# EAGLE design dlp.vco.v1.1.3.main (EAGLE 7.2.0)
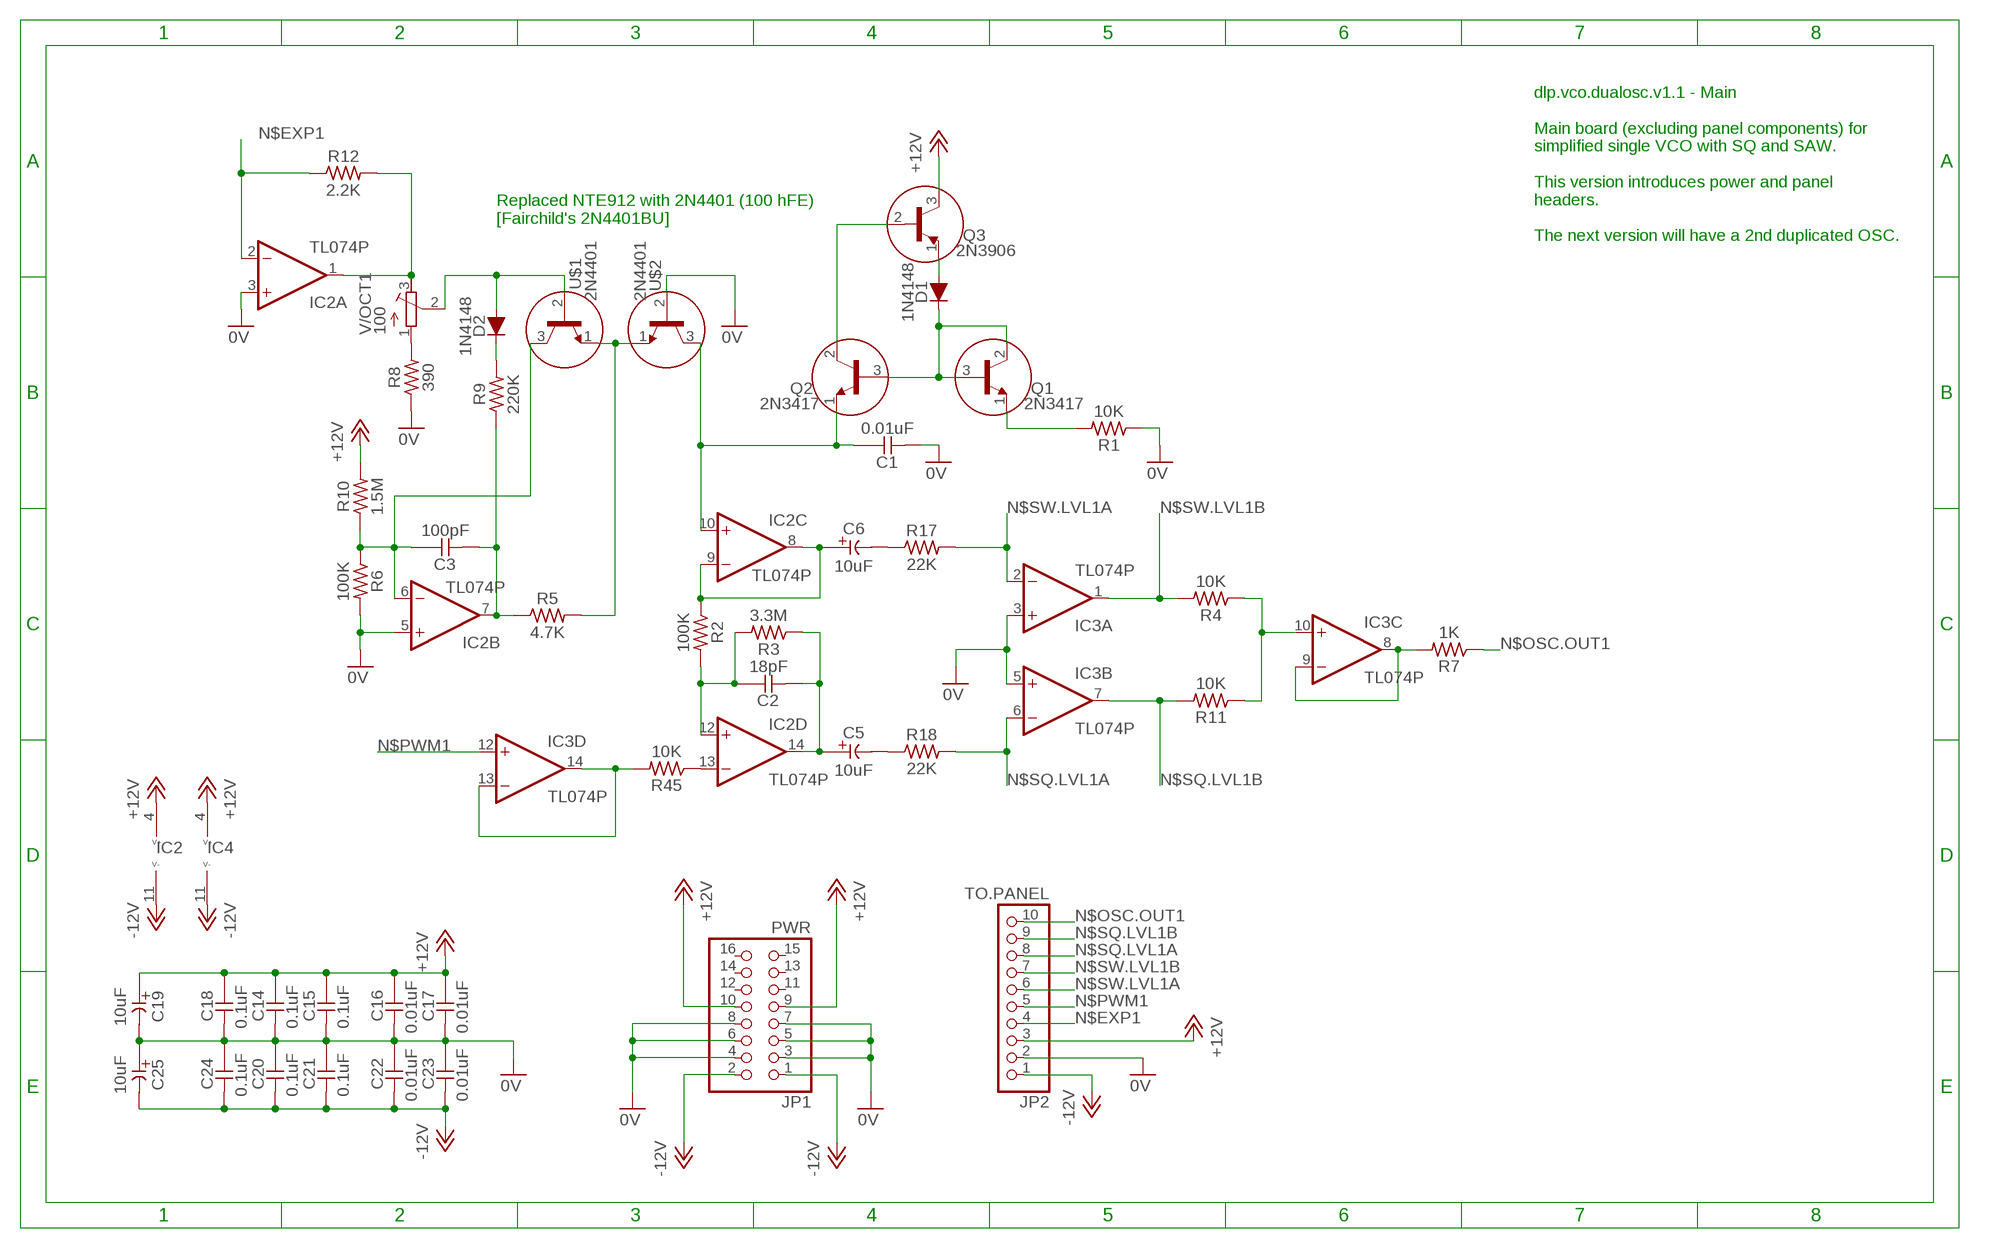
[diagram p0: schematic, sheet 1]

## Parts
C1  0.01uF  CC-US025-024X044  [C025-024X044]
C2  18pF  CC-US025-024X044  [C025-024X044]
C3  100pF  CC-US025-024X044  [C025-024X044]
C5  10uF  CE-USE2-5  [E2-5]
C6  10uF  CE-USE2-5  [E2-5]
C14  0.1uF  CC-US025-024X044  [C025-024X044]
C15  0.1uF  CC-US025-024X044  [C025-024X044]
C16  0.01uF  CC-US025-024X044  [C025-024X044]
C17  0.01uF  CC-US025-024X044  [C025-024X044]
C18  0.1uF  CC-US025-024X044  [C025-024X044]
C19  10uF  CE-USE2-5  [E2-5]
C20  0.1uF  CC-US025-024X044  [C025-024X044]
C21  0.1uF  CC-US025-024X044  [C025-024X044]
C22  0.01uF  CC-US025-024X044  [C025-024X044]
C23  0.01uF  CC-US025-024X044  [C025-024X044]
C24  0.1uF  CC-US025-024X044  [C025-024X044]
C25  10uF  CE-USE2-5  [E2-5]
D1  1N4148  [DO35-7]
D2  1N4148  [DO35-7]
IC2  TL074P  [DIL14]
IC3  TL074P  [DIL14]
JP1  PWR  PINHD-2X8  [2X08]
JP2  TO.PANEL  PINHD-1X10  [1X10]
Q1  2N3417  [TO92]
Q2  2N3417  [TO92]
Q3  2N3906  [TO92]
R1  10K  R0309/10  [0309/10]
R2  100K  R0309/10  [0309/10]
R3  3.3M  R0309/10  [0309/10]
R4  10K  R0309/10  [0309/10]
R5  4.7K  R0309/10  [0309/10]
R6  100K  R0309/10  [0309/10]
R7  1K  R0309/10  [0309/10]
R8  390  R0309/10  [0309/10]
R9  220K  R0309/10  [0309/10]
R10  1.5M  R0309/10  [0309/10]
R11  10K  R0309/10  [0309/10]
R12  2.2K  R0309/10  [0309/10]
R17  22K  R0309/10  [0309/10]
R18  22K  R0309/10  [0309/10]
R45  10K  R0309/10  [0309/10]
U$1  2N4401  [TO92]
U$2  2N4401  [TO92]
V/OCT1  100  R-TRIMM3296Y  [RTRIM3296Y]

## Nets
0V: C1.2 C14.2 C15.2 C16.2 C17.2 C18.2 C19.- C20.1 C21.1 C22.1 C23.1 C24.1 C25.+ IC2.3(A:+IN) IC2.5(B:+IN) IC3.3(A:+IN) IC3.5(B:+IN) JP1.3 JP1.4 JP1.5 JP1.6 JP1.7 JP1.8 JP2.2 R1.1 R6.2 R8.1 U$2.2(B)
+12V: C14.1 C15.1 C16.1 C17.1 C18.1 C19.+ IC2.4(P:V+) IC3.4(P:V+) JP1.9 JP1.10 JP2.3 Q3.3(C) R10.2
-12V: C20.2 C21.2 C22.2 C23.2 C24.2 C25.- IC2.11(P:V-) IC3.11(P:V-) JP1.1 JP1.2 JP2.1
N$1: C1.1 IC2.10(C:+IN) Q2.1(E) U$2.3(C)
N$2: Q2.2(C) Q3.2(B)
N$3: D1.A Q3.1(E)
N$4: C6.+ IC2.8(C:OUT) IC2.9(C:-IN) R2.1
N$5: D1.C Q1.2(C) Q1.3(B) Q2.3(B)
N$6: Q1.1(E) R1.2
N$7: C2.1 IC2.12(D:+IN) R2.2 R3.2
N$8: IC2.13(D:-IN) R45.1
N$9: C2.2 C5.+ IC2.14(D:OUT) R3.1
N$10: D2.A U$1.2(B) V/OCT1.2(S)
N$12: R5.2 U$1.1(E) U$2.1(E)
N$13: D2.C R9.2
N$14: R8.2 V/OCT1.1(A)
N$15: C3.1 IC2.6(B:-IN) R6.1 R10.1 U$1.3(C)
N$16: IC2.1(A:OUT) R12.2 V/OCT1.3(E)
N$18: IC3.10(C:+IN) R4.1 R11.1
N$20: IC3.8(C:OUT) IC3.9(C:-IN) R7.2
N$27: IC3.13(D:-IN) IC3.14(D:OUT) R45.2
N$29: C6.- R17.1
N$30: C5.- R18.1
N$37: C3.2 IC2.7(B:OUT) R5.1 R9.1
N$EXP1: IC2.2(A:-IN) JP2.4 R12.1
N$OSC.OUT1: JP2.10 R7.1
N$PWM1: IC3.12(D:+IN) JP2.5
N$SQ.LVL1A: IC3.6(B:-IN) JP2.8 R18.2
N$SQ.LVL1B: IC3.7(B:OUT) JP2.9 R11.2
N$SW.LVL1A: IC3.2(A:-IN) JP2.6 R17.2
N$SW.LVL1B: IC3.1(A:OUT) JP2.7 R4.2
Unconnected: JP1.11 JP1.12 JP1.13 JP1.14 JP1.15 JP1.16

## Notes on the sheet
- Replaced NTE912 with 2N4401 (100 hFE)
  [Fairchild's 2N4401BU]
- dlp.vco.dualosc.v1.1 - Main
  
  Main board (excluding panel components) for 
  simplified single VCO with SQ and SAW.
  
  This version introduces power and panel 
  headers.
  
  The next version will have a 2nd duplicated OSC.
- IC2 | IC4

## Library data of the parts
C1-C3 C14-C18 C20-C24 = _common:CC-US: CAPACITOR, US symbol
C5 C6 C19 C25 = _common:CE-US: ELECTROLYTIC CAPACITOR, US symbol
D1 D2 = _common:1N4148: DIODE high speed (Philips)
IC2 IC3 = _common:TL074: OP AMP
JP1 = pinhead:PINHD-2X8: PIN HEADER
JP2 = pinhead:PINHD-1X10: PIN HEADER
Q1 Q2 = _common:2N3417: NPN Transistor
Q3 = _common:2N3906: PNP Transistor
R1-R12 R17 R18 R45 = _common:R: RESISTOR, US symbol
U$1 U$2 = _common:2N4401
V/OCT1 = rcl:R-TRIMM: Trimm resistor

## Board
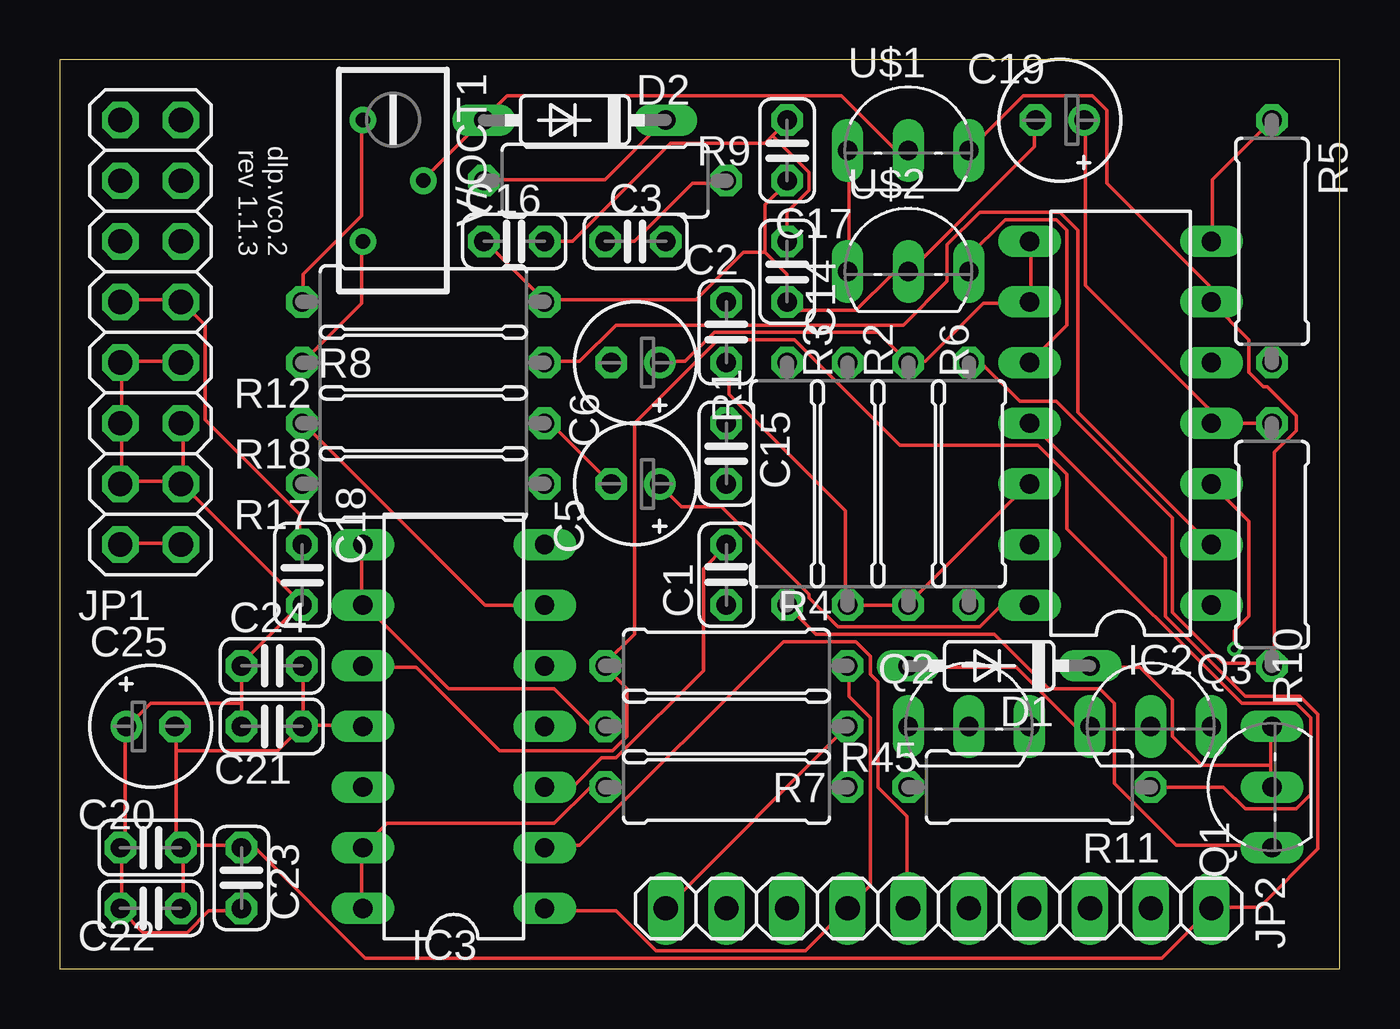
[diagram p1: board, top side]
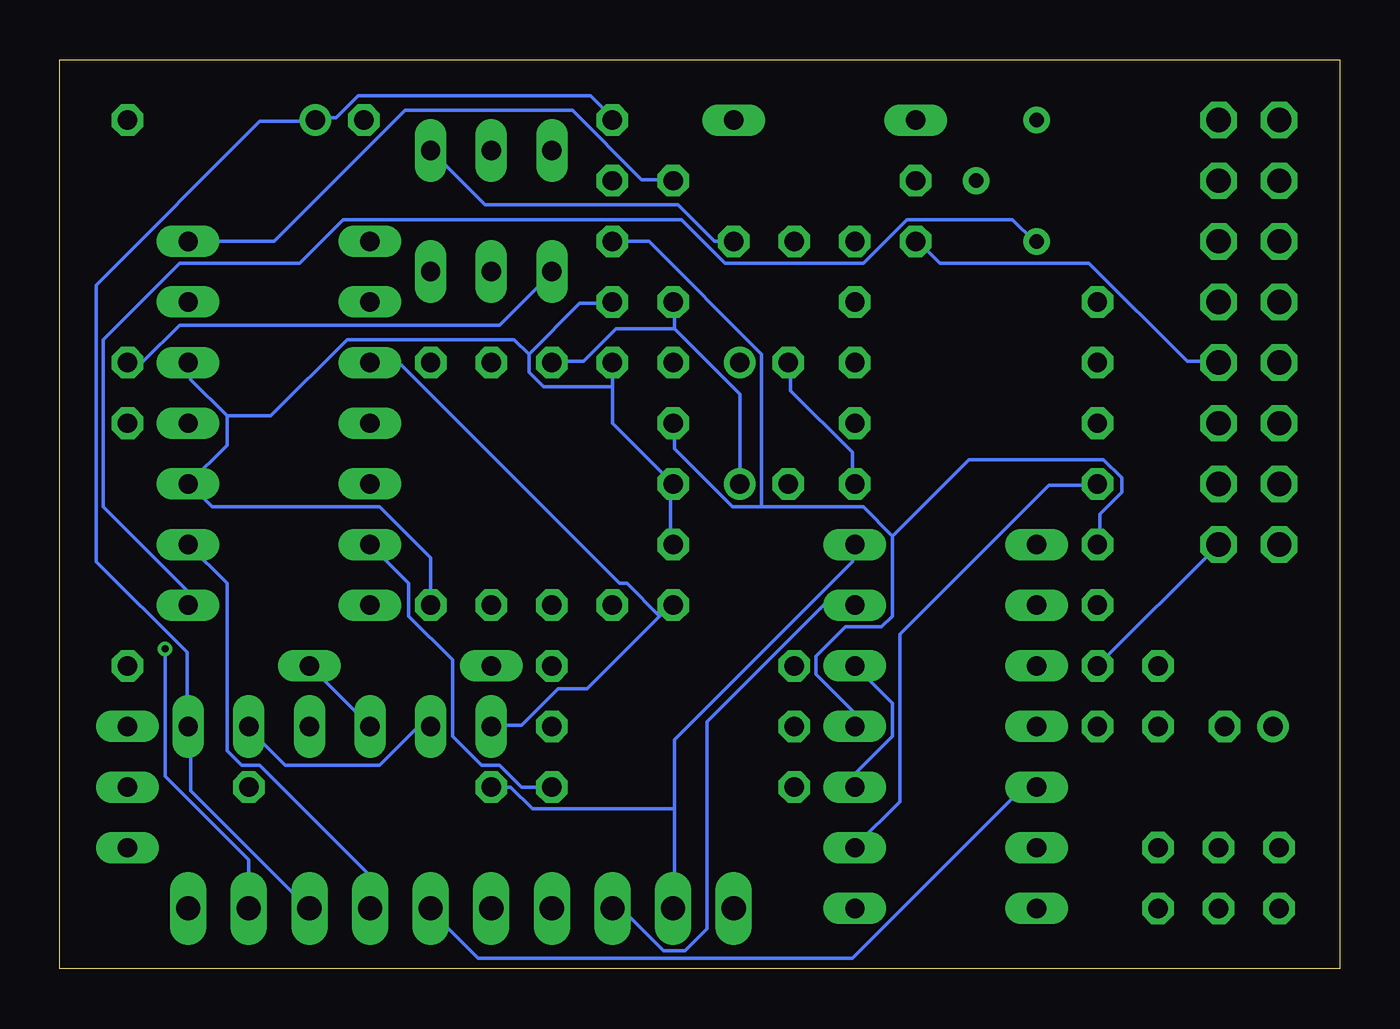
[diagram p2: board, bottom side, seen from below]

Size 53.65 x 38.09 mm. Coordinates in mm from the lower left corner, seen from the top.
Outline: 0,0 53.65,0 53.65,38.09 0,38.09 0,0
Copper layers (1*16): Top 0.035mm / dielectric 1.5mm / Bottom 0.035mm
Design rules "SeeedStudio_2layer_DRU_no_angle_20140221": minimum track width 6mil, minimum drill 12mil, track to track 6mil, track to pad 6mil, pad to pad 6mil, via to via 6mil, smd to smd 0mil, copper to edge 10mil, drill to drill 10mil, minimum pad ring 10mil, minimum via ring 6mil, stop-mask expansion 2mil, vias tented up to drill 100mil, thermal gap 10mil

### Footprints (pad centres in the part's own frame; a part is rotated, then mirrored left to right if it is on the bottom)
C025-024X044 = drill 0.813 octagon: 1 -1.27,0; 2 1.27,0
E2-5 = drill 0.813 pad 1.27: + -1.016,0 | drill 0.813 pad 1.27 octagon: - 1.016,0
DO35-7 = drill 0.813 long: A 3.81,0; C -3.81,0
DIL14 = drill 0.813 long: 1 -7.62,-3.81; 2 -5.08,-3.81; 3 -2.54,-3.81; 4 0,-3.81; 5 2.54,-3.81; 6 5.08,-3.81; 7 7.62,-3.81; 8 7.62,3.81; 9 5.08,3.81; 10 2.54,3.81; 11 0,3.81; 12 -2.54,3.81; 13 -5.08,3.81; 14 -7.62,3.81
2X08 = drill 1.016 octagon: 1 -8.89,-1.27; 2 -8.89,1.27; 3 -6.35,-1.27; 4 -6.35,1.27; 5 -3.81,-1.27; 6 -3.81,1.27; 7 -1.27,-1.27; 8 -1.27,1.27; 9 1.27,-1.27; 10 1.27,1.27; 11 3.81,-1.27; 12 3.81,1.27; 13 6.35,-1.27; 14 6.35,1.27; 15 8.89,-1.27; 16 8.89,1.27
1X10 = drill 1.016 long: 1 -11.43,0; 2 -8.89,0; 3 -6.35,0; 4 -3.81,0; 5 -1.27,0; 6 1.27,0; 7 3.81,0; 8 6.35,0; 9 8.89,0; 10 11.43,0
TO92 = drill 0.813 long: 1 -2.54,-1.27; 2 0,-1.27; 3 2.54,-1.27
0309/10 = drill 0.813 octagon: 1 -5.08,0; 2 5.08,0
RTRIM3296Y = drill 0.61: 1 1.27,-2.54; 2 -1.27,0; 3 1.27,2.54

### Placement (x,y rotation side)
C1  27.94,16.51 90 top
C2  27.94,26.67 90 top
C3  24.13,30.48 180 top
C5  24.13,20.32 180 top
C6  24.13,25.4 180 top
C14  30.48,29.21 270 top
C15  27.94,21.59 270 top
C16  19.05,30.48 180 top
C17  30.48,34.29 270 top
C18  10.16,16.51 270 top
C19  41.91,35.56 180 top
C20  3.81,5.08 0 top
C21  8.89,10.16 0 top
C22  3.81,2.54 0 top
C23  7.62,3.81 90 top
C24  8.89,12.7 0 top
C25  3.81,10.16 0 top
D1  39.37,12.7 180 top
D2  21.59,35.56 180 top
IC2  44.45,22.86 90 top
IC3  16.51,10.16 90 top
JP1  3.81,26.67 90 top
JP2  36.83,2.54 180 top
Q1  49.53,7.62 90 top
Q2  38.1,11.43 0 top
Q3  45.72,11.43 0 top
R1  30.48,20.32 270 top
R2  35.56,20.32 270 top
R3  33.02,20.32 270 top
R4  27.94,12.7 0 top
R5  50.8,30.48 270 top
R6  38.1,20.32 270 top
R7  27.94,10.16 180 top
R8  15.24,27.94 180 top
R9  22.86,33.02 180 top
R10  50.8,17.78 90 top
R11  40.64,7.62 180 top
R12  15.24,25.4 180 top
R17  15.24,20.32 180 top
R18  15.24,22.86 180 top
R45  27.94,7.62 180 top
U$1  35.56,35.56 0 top
U$2  35.56,30.48 0 top
V/OCT1  13.97,33.02 180 top

### Tracks (layer width: path | path; a pad name or v marks a point on that pad's centre or on a via)
0V  (via drill 0.3)
  Top 0.152: v49.23,13.41 49.23,14.17 49.84,14.78 49.84,18.75 IC2.3 | JP1.7 5.03,25.45 2.59,25.45 JP1.8 2.59,25.3 2.59,22.86 | 2.59,22.86 2.59,20.42 | JP1.3 5.18,20.42 5.18,22.86 JP1.5 | 2.59,20.42 5.03,20.42 JP1.3 | 2.59,20.42 JP1.4 | 2.59,22.86 JP1.6 | 7.62,11.12 C24.1 7.62,12.8 10.06,15.24 C18.2 10.21,15.24 5.18,20.27 JP1.3 | 7.62,11.12 C21.1 | C23.1 7.62,2.44 6.25,2.44 5.33,1.52 3.5,1.52 2.59,2.44 C22.1 2.59,2.59 2.59,5.03 C20.1 2.59,5.18 2.74,5.33 2.74,10.06 C25.+ 2.9,10.21 3.81,11.12 7.62,11.12 | IC3.3 21.49,7.62 22.71,8.84 23.32,8.84 26.98,12.5 26.98,16.76 27.89,17.68 C1.2 | C16.2 17.83,30.48 20.27,28.04 R8.1 20.42,28.04 26.67,28.04 28.65,30.02 29.57,30.02 | 29.57,30.02 30.48,29.11 C14.2 30.48,27.89 30.79,27.58 33.38,27.58 34.9,29.11 35.51,29.11 U$2.2 35.66,29.26 40.84,34.44 40.84,35.51 C19.- | 29.57,30.02 29.57,32 30.48,32.92 C17.2
  Bottom 0.152: R6.2 38.1,17.22 40.23,19.36 47.24,19.36 48.16,20.27 IC2.3 46.63,21.95 46.63,23.16 | 46.63,23.16 48.16,24.69 48.16,25.3 IC2.5 | JP2.2 45.72,4.57 49.23,8.08 v49.23,13.41 | IC3.5 18.75,11.12 18.75,9.75 20.27,8.23 20.27,7.62 IC3.3 | C1.2 28.04,17.83 28.04,20.27 C15.2 30.48,22.86 30.48,24.38 | 30.48,24.38 R1.1 | 30.48,24.38 33.38,24.38 33.98,24.99 33.98,25.76 | 33.98,25.76 31.85,27.89 30.48,27.89 C14.2 | JP1.7 5.18,25.45 6.4,25.45 10.52,29.57 16.76,29.57 17.68,30.48 C16.2 | 46.63,23.16 44.81,23.16 41.6,26.36 34.59,26.36 33.98,25.76
+12V
  Top 0.152: C18.1 10.06,17.83 10.06,19.05 6.1,23.01 6.1,26.98 5.18,27.89 JP1.9 5.03,28.04 2.59,28.04 JP1.10 | R10.2 IC2.4 48.16,22.86 48.16,23.47 42.98,28.65 42.98,35.51 C19.+ | C16.1 21.49,30.48 25.6,34.59 29.57,34.59 29.87,34.9 | 29.87,34.9 30.48,35.51 C17.1 | C14.1 30.48,31.7 31.39,32.61 31.39,33.38 29.87,34.9
  Bottom 0.152: 18.75,18.14 18.75,14.78 19.2,14.33 20.73,14.33 21.95,13.11 21.95,12.34 20.42,10.82 20.42,10.21 IC3.4 | 18.75,18.14 19.96,19.36 24.23,19.36 | 24.23,19.36 25.45,19.36 27.89,21.79 27.89,22.86 C15.1 | 18.75,18.14 15.54,21.34 9.91,21.34 9.14,20.57 9.14,19.96 10.06,19.05 10.06,17.83 C18.1 | JP2.3 43.28,2.59 48.16,7.47 48.16,10.06 Q3.3 48.31,10.21 48.31,13.26 52.12,17.07 52.12,28.65 45.26,35.51 42.98,35.51 C19.+ 42.82,35.66 42.06,35.66 41.15,36.58 31.39,36.58 30.48,35.66 C17.1 | 24.23,19.36 24.23,25.76 28.96,30.48 C14.1
-12V
  Top 0.152: C22.2 5.18,2.59 5.18,5.03 C20.2 | C20.2 5.18,5.18 7.62,5.18 C23.2 7.62,5.03 8.23,5.03 12.8,0.46 46.18,0.46 JP2.1 48.31,2.59 50.29,2.59 52.73,5.03 52.73,10.67 51.97,11.43 49.68,11.43 46.33,14.78 46.33,17.22 40.69,22.86 IC2.11 | 4.88,9.14 4.88,5.33 5.03,5.18 C20.2 | 4.88,9.14 4.88,10.06 C25.- | JP1.2 2.59,17.83 5.03,17.83 JP1.1 | 10.21,10.21 10.21,12.65 C24.2 | 10.21,10.21 12.65,10.21 IC3.11 | 10.21,10.21 C21.2 9.14,9.14 4.88,9.14
  Bottom 0.152: C24.2 JP1.1
N$1
  Top 0.152: U$2.3 38.1,29.87 39.62,31.39 41.76,31.39 42.22,30.94 42.22,26.98 IC2.10
  Bottom 0.152: 28.5,14.78 28.04,15.24 C1.1 | 28.5,14.78 31.55,11.73 32.77,11.73 34.29,10.21 35.51,10.21 Q2.1 | 28.5,14.78 29.87,16.15 30.18,16.15 39.32,25.3 40.54,25.3 IC2.10
N$2
  Bottom 0.152: Q2.2 38.1,10.06 38.71,10.06 40.23,8.53 44.2,8.53 45.72,10.06 Q3.2
N$3
  Top 0.152: Q3.1 43.13,10.21 42.52,10.21 40.08,12.65 35.66,12.65 D1.A
N$4
  Top 0.152: IC2.8 40.69,30.48 40.69,28.04 IC2.9 40.54,27.89 38.71,27.89 36.27,25.45 35.66,25.45 R2.1 34.29,26.67 27.43,26.67 26.21,25.45 25.15,25.45 C6.+
N$5
  Top 0.152: 50.75,8.53 50.75,10.06 Q1.3 | 50.75,8.53 50.75,7.62 Q1.2 | 50.75,8.53 47.85,8.53 46.63,9.75 46.63,11.28 45.26,12.65 43.28,12.65 D1.C
  Bottom 0.152: D1.C Q2.3
N$6
  Top 0.152: R1.2 31.7,14.02 39.17,14.02 41.45,11.73 43.59,11.73 44.2,11.12 44.2,7.77 46.79,5.18 50.75,5.18 Q1.1
N$7
  Top 0.152: C2.1 28.04,25.3 28.04,24.08 32.92,19.2 32.92,15.24 R3.2 35.51,15.24 | 35.51,15.24 40.54,20.27 IC2.12 | 35.51,15.24 R2.2
N$8
  Bottom 0.152: R45.1 34.29,7.62 35.2,8.53 35.97,8.53 37.19,9.75 37.19,12.95 39.01,14.78 39.01,16.15 IC2.13
N$9
  Top 0.152: IC2.14 39.47,15.24 38.56,14.33 32.61,14.33 31.39,15.54 31.39,15.7 27.74,19.36 26.06,19.36 25.15,20.27 C5.+
  Bottom 0.152: C5.+ 25.15,24.08 27.89,26.82 | 27.89,26.82 27.89,27.89 C2.2 | 27.89,26.82 30.33,26.82 31.7,25.45 32.92,25.45 R3.1
N$10
  Top 0.152: V/OCT1.2 15.24,33.07 17.68,35.51 D2.A 17.83,35.66 18.75,36.58 32.77,36.58 35.05,34.29 U$1.2
N$12
  Top 0.152: U$2.1 33.07,29.26 33.07,34.29 U$1.1
  Bottom 0.152: R5.2 50.75,25.45 50.14,25.45 48.62,26.98 35.2,26.98 33.07,29.11 U$2.1
N$13
  Top 0.152: R9.2 17.83,33.07 22.86,33.07 25.3,35.51 D2.C
N$14
  Top 0.152: V/OCT1.1 12.65,35.51 12.65,31.55 10.21,29.11 10.21,28.04 R8.2
N$15
  Top 0.152: R6.1 38.1,25.3 38.71,25.3 40.23,23.77 41.76,23.77 46.63,18.9 46.63,14.94 48.77,12.8 50.75,12.8 R10.1 50.9,12.8 50.9,21.64 51.82,22.55 51.82,23.16 50.6,24.38 50.44,24.38 49.84,24.99 49.84,26.36 IC2.6 48.16,28.04 48.16,28.65 43.89,32.92 43.89,35.97 43.28,36.58 40.39,36.58 U$1.3
  Bottom 0.152: C3.1 26.21,30.48 27.74,32 35.81,32 U$1.3
N$16
  Top 0.152: R12.2 12.65,27.89 12.65,30.48 V/OCT1.3
  Bottom 0.152: IC2.1 48.31,15.24 48.31,15.85 51.82,19.36 51.82,26.36 48.62,29.57 43.59,29.57 41.76,31.39 27.58,31.39 25.76,29.57 19.96,29.57 18.14,31.39 13.72,31.39 12.8,30.48 V/OCT1.3
N$18
  Top 0.152: IC3.10 12.8,12.65 14.94,12.65 18.44,9.14 23.16,9.14 23.77,9.75 23.77,11.73 22.86,12.65 R4.1 22.86,12.8 24.08,14.02 24.08,22.86 27.58,26.36 30.79,26.36 35.2,21.95 41,21.95 42.22,20.73 42.22,18.44 49.53,11.12 51.82,11.12 52.43,10.52 52.43,7.32 51.82,6.71 49.68,6.71 48.77,7.62 R11.1
N$20
  Top 0.152: IC3.8 12.65,17.68 12.65,15.24 IC3.9 12.8,15.24 16.31,11.73 20.73,11.73 22.25,10.21 22.86,10.21 R7.2
N$27
  Top 0.152: IC3.14 12.65,2.59 12.65,5.03 IC3.13 13.72,6.1 20.73,6.1 22.25,7.62 R45.2
N$29
  Bottom 0.152: R17.1 20.42,20.42 20.42,21.64 23.01,24.23 23.01,25.3 C6.-
N$30
  Top 0.152: C5.- 20.57,22.86 R18.1
N$37
  Top 0.152: C3.2 24.08,30.48 26.52,32.92 27.89,32.92 R9.1 | R5.1 48.31,33.07 48.31,30.48 IC2.7
  Bottom 0.152: IC2.7 44.65,30.48 39.17,35.97 32.16,35.97 29.26,33.07 28.04,33.07 R9.1
N$EXP1
  Top 0.152: R12.1 20.42,25.45 21.79,25.45 23.32,26.98 35.36,26.98 37.19,28.8 37.19,30.33 38.56,31.7 41.91,31.7 42.67,30.94 42.67,23.32 48.16,17.83 IC2.2
  Bottom 0.152: IC2.2 46.63,16.15 46.63,9.14 46.02,8.53 45.26,8.53 40.69,3.96 40.69,2.59 JP2.4
N$OSC.OUT1
  Top 0.152: JP2.10 R7.1
N$PWM1
  Bottom 0.152: IC3.12 13.26,7.62 20.42,0.46 36.12,0.46 38.1,2.44 JP2.5
N$SQ.LVL1A
  Top 0.152: IC3.6 17.83,15.24 10.21,22.86 R18.2
  Bottom 0.152: IC3.6 21.64,15.24 26.52,10.36 26.52,1.68 27.43,0.76 28.35,0.76 30.02,2.44 30.48,2.44 JP2.8
N$SQ.LVL1B
  Bottom 0.152: 27.89,6.71 27.89,2.59 JP2.9 | 27.89,6.71 27.89,9.6 20.42,17.07 20.42,17.68 IC3.7 | R11.2 34.75,7.62 33.83,6.71 27.89,6.71
N$SW.LVL1A
  Top 0.152: JP2.6 35.51,2.59 35.51,6.4 34.29,7.62 34.29,12.04 33.98,12.34 33.98,13.11 33.38,13.72 30.33,13.72 21.79,5.18 20.42,5.18 IC3.2
  Bottom 0.152: R17.2 10.21,20.27 12.19,20.27 18.44,14.02 18.44,7.01 20.27,5.18 IC3.2
N$SW.LVL1B
  Top 0.152: IC3.1 20.42,2.44 23.32,2.44 24.99,0.76 31.24,0.76 JP2.7 33.98,3.5 33.98,10.52 33.07,11.43 33.07,12.65 R4.2

### Text on the board
tNames: dlp.vco.2 / rev 1.1.3